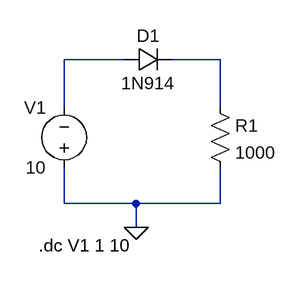
[diagram p0: schematic reverse bias diode.asc]
reverse bias diode.asc, the LTspice schematic file:
Version 4
SHEET 1 880 680
WIRE 144 64 64 64
WIRE 272 64 208 64
WIRE 64 128 64 64
WIRE 272 128 272 64
WIRE 64 256 64 208
WIRE 160 256 64 256
WIRE 272 256 272 208
WIRE 272 256 160 256
WIRE 160 288 160 256
FLAG 160 288 0
SYMBOL res 256 112 R0
SYMATTR InstName R1
SYMATTR Value 1000
SYMBOL diode 144 80 R270
WINDOW 0 32 32 VTop 2
WINDOW 3 0 32 VBottom 2
SYMATTR InstName D1
SYMATTR Value 1N914
SYMBOL voltage 64 224 R180
WINDOW 0 24 96 Left 2
WINDOW 3 24 16 Left 2
WINDOW 123 0 0 Left 0
WINDOW 39 0 0 Left 0
SYMATTR InstName V1
SYMATTR Value 10
TEXT 30 312 Left 2 !.dc V1 1 10

The netlist it stands for:
* reverse bias diode.asc
R1 N002 0 1000
D1 N001 N002 1N914
V1 0 N001 10
.model D D
.lib standard.dio
.dc V1 1 10
.backanno
.end